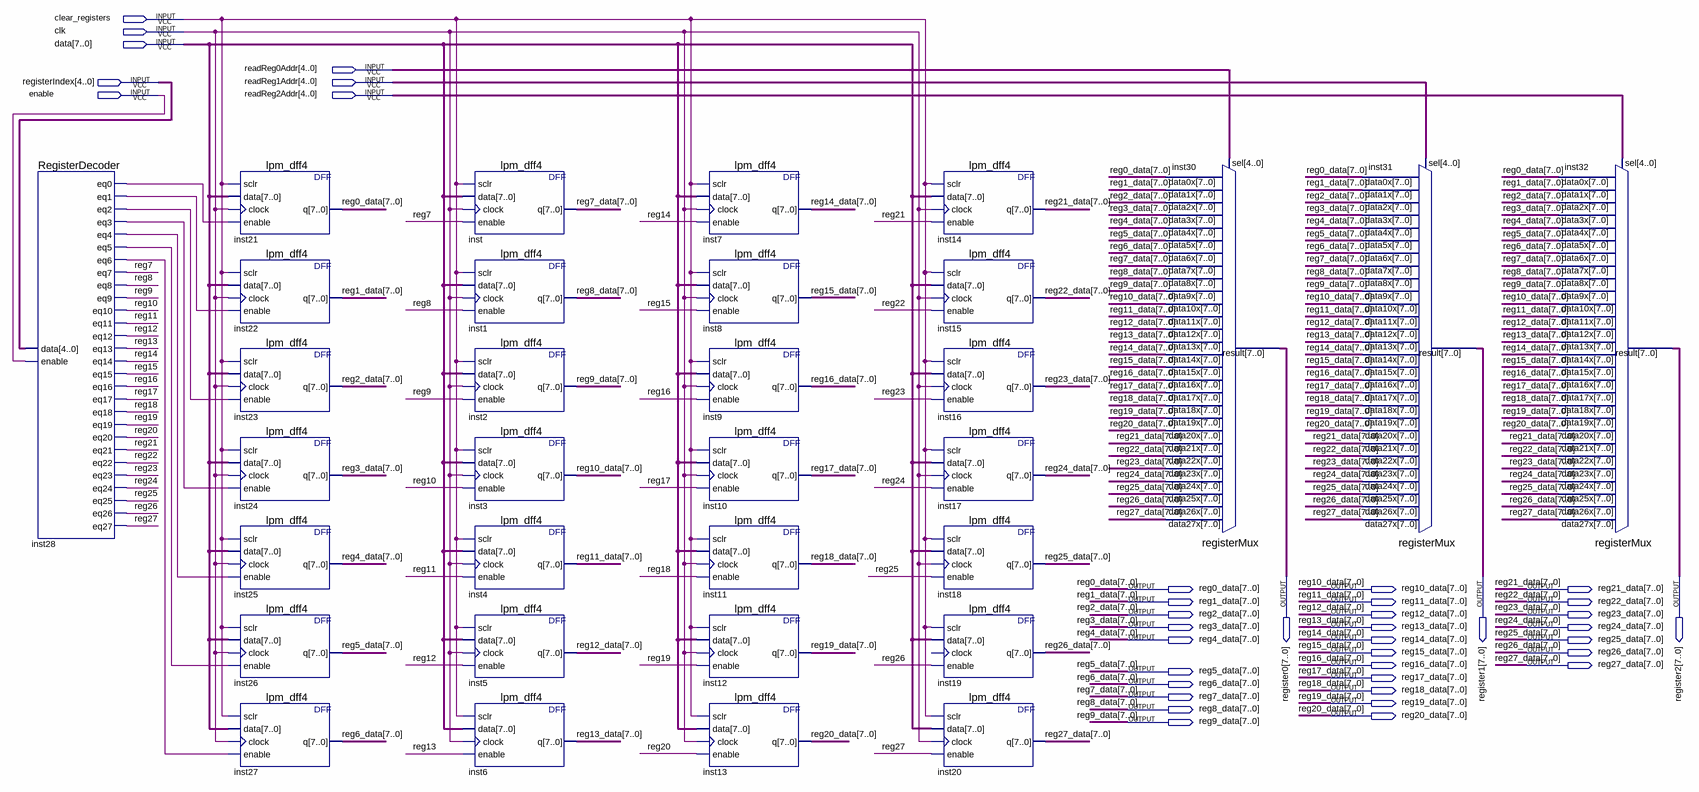
[diagram p0: schematic sheet]
// Quartus schematic RegisterBlock.bdf as structural Verilog: 32 symbols, 39 pins
module RegisterBlock (
  input  clear_registers,
  input  clk,
  input  [7:0] data,
  input  [4:0] readReg0Addr,
  input  [4:0] registerIndex,
  input  [4:0] readReg1Addr,
  input  enable,
  input  [4:0] readReg2Addr,
  output [7:0] register0,
  output [7:0] register1,
  output [7:0] register2,
  output [7:0] reg0_data,
  output [7:0] reg10_data,
  output [7:0] reg21_data,
  output [7:0] reg1_data,
  output [7:0] reg11_data,
  output [7:0] reg22_data,
  output [7:0] reg2_data,
  output [7:0] reg12_data,
  output [7:0] reg23_data,
  output [7:0] reg3_data,
  output [7:0] reg13_data,
  output [7:0] reg24_data,
  output [7:0] reg4_data,
  output [7:0] reg14_data,
  output [7:0] reg25_data,
  output [7:0] reg15_data,
  output [7:0] reg26_data,
  output [7:0] reg16_data,
  output [7:0] reg27_data,
  output [7:0] reg5_data,
  output [7:0] reg17_data,
  output [7:0] reg6_data,
  output [7:0] reg18_data,
  output [7:0] reg7_data,
  output [7:0] reg19_data,
  output [7:0] reg8_data,
  output [7:0] reg20_data,
  output [7:0] reg9_data
);

  wire inst28_eq0, inst28_eq1, inst28_eq2, inst28_eq3, inst28_eq4, inst28_eq5, inst28_eq6, reg7, reg8, reg9,
       reg10, reg11, reg12, reg13, reg14, reg15, reg16, reg17, reg18, reg19, reg20, reg21, reg22, reg23,
       reg24, reg25, reg26, reg27;

  RegisterDecoder inst28 (
    .data(registerIndex), .enable(enable), .eq0(inst28_eq0), .eq1(inst28_eq1), .eq2(inst28_eq2),
    .eq3(inst28_eq3), .eq4(inst28_eq4), .eq5(inst28_eq5), .eq6(inst28_eq6), .eq7(reg7), .eq8(reg8),
    .eq9(reg9), .eq10(reg10), .eq11(reg11), .eq12(reg12), .eq13(reg13), .eq14(reg14), .eq15(reg15),
    .eq16(reg16), .eq17(reg17), .eq18(reg18), .eq19(reg19), .eq20(reg20), .eq21(reg21), .eq22(reg22),
    .eq23(reg23), .eq24(reg24), .eq25(reg25), .eq26(reg26), .eq27(reg27));
  lpm_dff4 inst21 (.sclr(clear_registers), .data(data), .clock(clk), .enable(inst28_eq0), .q(reg0_data));
  lpm_dff4 inst22 (.sclr(clear_registers), .data(data), .clock(clk), .enable(inst28_eq1), .q(reg1_data));
  lpm_dff4 inst23 (.sclr(clear_registers), .data(data), .clock(clk), .enable(inst28_eq2), .q(reg2_data));
  lpm_dff4 inst24 (.sclr(clear_registers), .data(data), .clock(clk), .enable(inst28_eq3), .q(reg3_data));
  lpm_dff4 inst25 (.sclr(clear_registers), .data(data), .clock(clk), .enable(inst28_eq4), .q(reg4_data));
  lpm_dff4 inst26 (.sclr(clear_registers), .data(data), .clock(clk), .enable(inst28_eq5), .q(reg5_data));
  lpm_dff4 inst27 (.sclr(clear_registers), .data(data), .clock(clk), .enable(inst28_eq6), .q(reg6_data));
  lpm_dff4 inst (.sclr(clear_registers), .data(data), .clock(clk), .enable(reg7), .q(reg7_data));
  lpm_dff4 inst1 (.sclr(clear_registers), .data(data), .clock(clk), .enable(reg8), .q(reg8_data));
  lpm_dff4 inst2 (.sclr(clear_registers), .data(data), .clock(clk), .enable(reg9), .q(reg9_data));
  lpm_dff4 inst3 (.sclr(clear_registers), .data(data), .clock(clk), .enable(reg10), .q(reg10_data));
  lpm_dff4 inst4 (.sclr(clear_registers), .data(data), .clock(clk), .enable(reg11), .q(reg11_data));
  lpm_dff4 inst5 (.sclr(clear_registers), .data(data), .clock(clk), .enable(reg12), .q(reg12_data));
  lpm_dff4 inst6 (.sclr(clear_registers), .data(data), .clock(clk), .enable(reg13), .q(reg13_data));
  lpm_dff4 inst7 (.sclr(clear_registers), .data(data), .clock(clk), .enable(reg14), .q(reg14_data));
  lpm_dff4 inst8 (.sclr(clear_registers), .data(data), .clock(clk), .enable(reg15), .q(reg15_data));
  lpm_dff4 inst9 (.sclr(clear_registers), .data(data), .clock(clk), .enable(reg16), .q(reg16_data));
  lpm_dff4 inst10 (.sclr(clear_registers), .data(data), .clock(clk), .enable(reg17), .q(reg17_data));
  lpm_dff4 inst11 (.sclr(clear_registers), .data(data), .clock(clk), .enable(reg18), .q(reg18_data));
  lpm_dff4 inst12 (.sclr(clear_registers), .data(data), .clock(clk), .enable(reg19), .q(reg19_data));
  lpm_dff4 inst13 (.sclr(clear_registers), .data(data), .clock(clk), .enable(reg20), .q(reg20_data));
  lpm_dff4 inst14 (.sclr(clear_registers), .data(data), .clock(clk), .enable(reg21), .q(reg21_data));
  lpm_dff4 inst15 (.sclr(clear_registers), .data(data), .clock(clk), .enable(reg22), .q(reg22_data));
  lpm_dff4 inst16 (.sclr(clear_registers), .data(data), .clock(clk), .enable(reg23), .q(reg23_data));
  lpm_dff4 inst17 (.sclr(clear_registers), .data(data), .clock(clk), .enable(reg24), .q(reg24_data));
  lpm_dff4 inst18 (.sclr(clear_registers), .data(data), .clock(clk), .enable(reg25), .q(reg25_data));
  lpm_dff4 inst19 (.sclr(clear_registers), .data(data), .enable(reg26), .q(reg26_data));  // open: clock
  lpm_dff4 inst20 (.sclr(clear_registers), .data(data), .clock(clk), .enable(reg27), .q(reg27_data));
  registerMux inst30 (
    .data27x(reg27_data), .data26x(reg26_data), .data25x(reg25_data), .data24x(reg24_data),
    .data23x(reg23_data), .data22x(reg22_data), .data21x(reg21_data), .data20x(reg20_data),
    .data19x(reg19_data), .data18x(reg18_data), .data17x(reg17_data), .data16x(reg16_data),
    .data15x(reg15_data), .data14x(reg14_data), .data13x(reg13_data), .data12x(reg12_data),
    .data11x(reg11_data), .data10x(reg10_data), .data9x(reg9_data), .data8x(reg8_data), .data7x(reg7_data),
    .data6x(reg6_data), .data5x(reg5_data), .data4x(reg4_data), .data3x(reg3_data), .data2x(reg2_data),
    .data1x(reg1_data), .data0x(reg0_data), .sel(readReg0Addr), .result(register0));
  registerMux inst31 (
    .data27x(reg27_data), .data26x(reg26_data), .data25x(reg25_data), .data24x(reg24_data),
    .data23x(reg23_data), .data22x(reg22_data), .data21x(reg21_data), .data20x(reg20_data),
    .data19x(reg19_data), .data18x(reg18_data), .data17x(reg17_data), .data16x(reg16_data),
    .data15x(reg15_data), .data14x(reg14_data), .data13x(reg13_data), .data12x(reg12_data),
    .data11x(reg11_data), .data10x(reg10_data), .data9x(reg9_data), .data8x(reg8_data), .data7x(reg7_data),
    .data6x(reg6_data), .data5x(reg5_data), .data4x(reg4_data), .data3x(reg3_data), .data2x(reg2_data),
    .data1x(reg1_data), .data0x(reg0_data), .sel(readReg1Addr), .result(register1));
  registerMux inst32 (
    .data27x(reg27_data), .data26x(reg26_data), .data25x(reg25_data), .data24x(reg24_data),
    .data23x(reg23_data), .data22x(reg22_data), .data21x(reg21_data), .data20x(reg20_data),
    .data19x(reg19_data), .data18x(reg18_data), .data17x(reg17_data), .data16x(reg16_data),
    .data15x(reg15_data), .data14x(reg14_data), .data13x(reg13_data), .data12x(reg12_data),
    .data11x(reg11_data), .data10x(reg10_data), .data9x(reg9_data), .data8x(reg8_data), .data7x(reg7_data),
    .data6x(reg6_data), .data5x(reg5_data), .data4x(reg4_data), .data3x(reg3_data), .data2x(reg2_data),
    .data1x(reg1_data), .data0x(reg0_data), .sel(readReg2Addr), .result(register2));
endmodule
